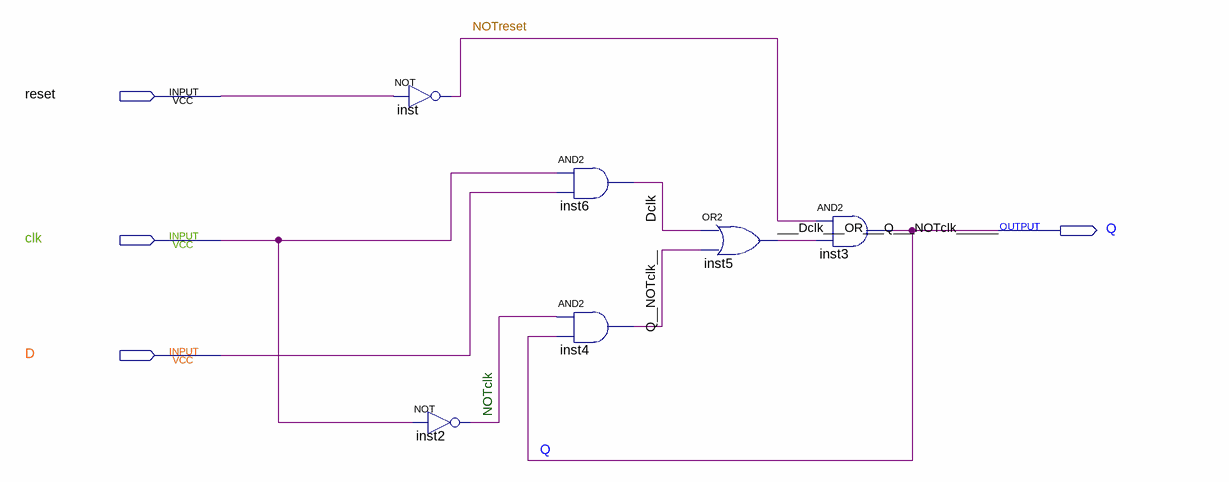
[diagram p0: schematic sheet]
// Quartus schematic DSwitch.bdf as structural Verilog: 6 symbols, 4 pins
module DSwitch (
  input  reset,
  input  clk,
  input  D,
  output Q
);

  wire ___Dclk___OR___Q___NOTclk______, Dclk, NOTclk, NOTreset, Q__NOTclk__;

  not inst (NOTreset, reset);
  not inst2 (NOTclk, clk);
  and inst6 (Dclk, clk, D);
  and inst4 (Q__NOTclk__, NOTclk, Q);
  or inst5 (___Dclk___OR___Q___NOTclk______, Dclk, Q__NOTclk__);
  and inst3 (Q, NOTreset, ___Dclk___OR___Q___NOTclk______);
endmodule
